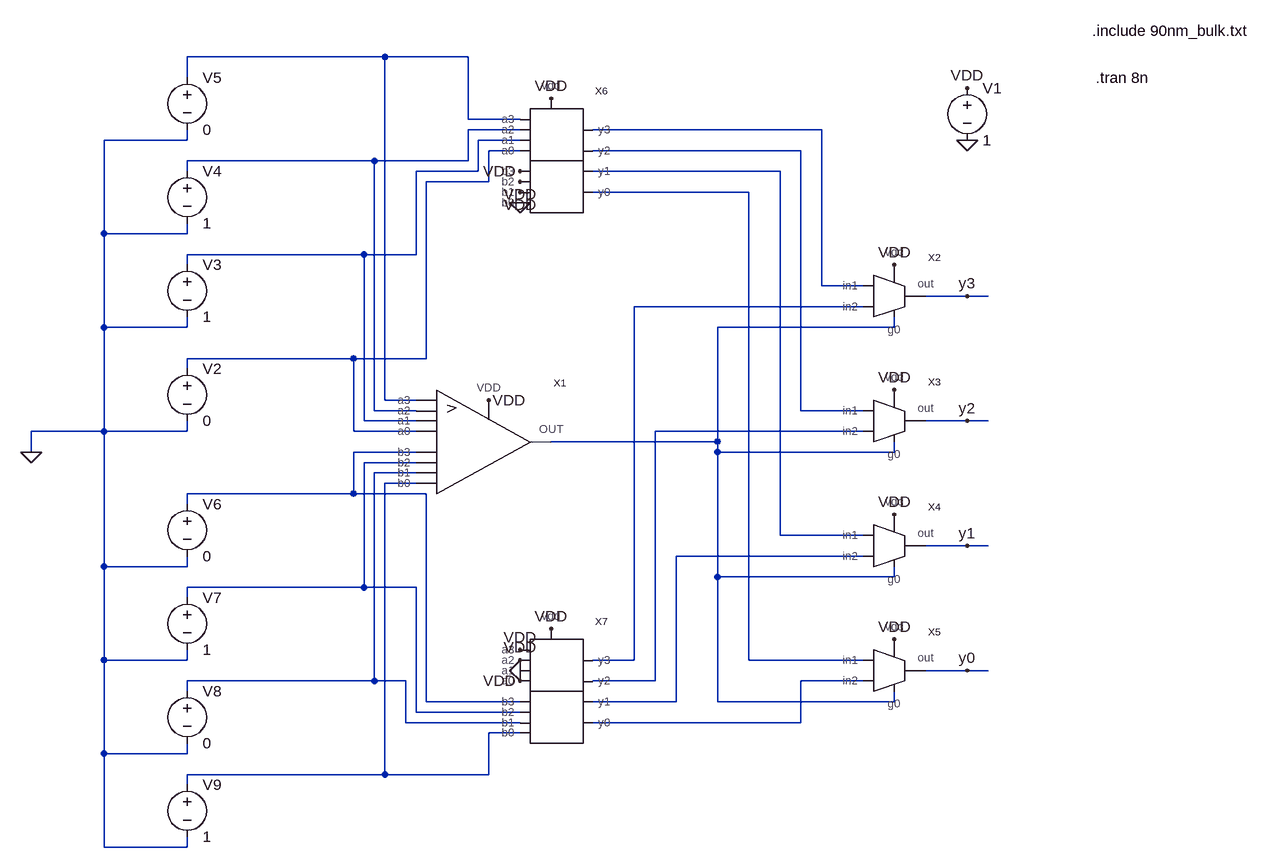
[diagram p0: schematic 2_exp2.asc]
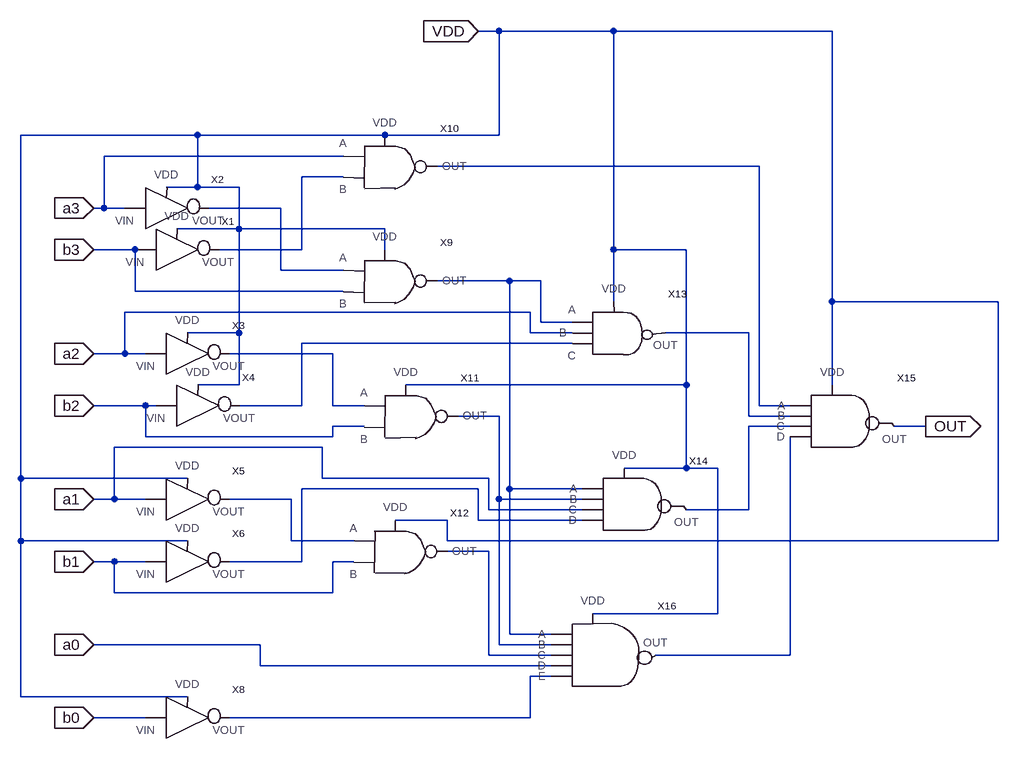
[diagram p1: sub-circuit comparator.asc]
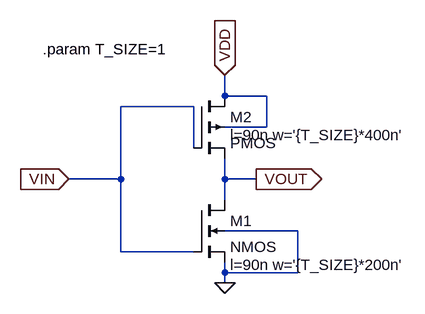
[diagram p2: sub-circuit inverter.asc]
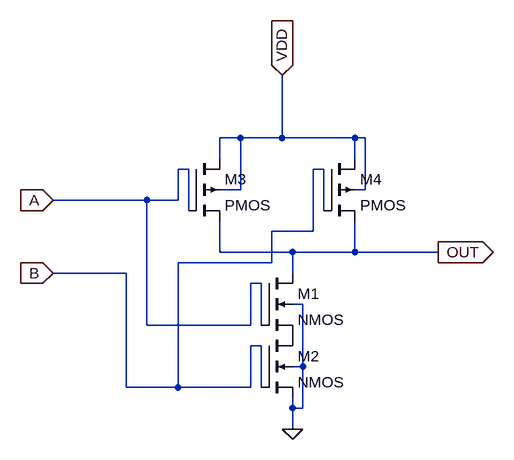
[diagram p3: sub-circuit nand.asc]
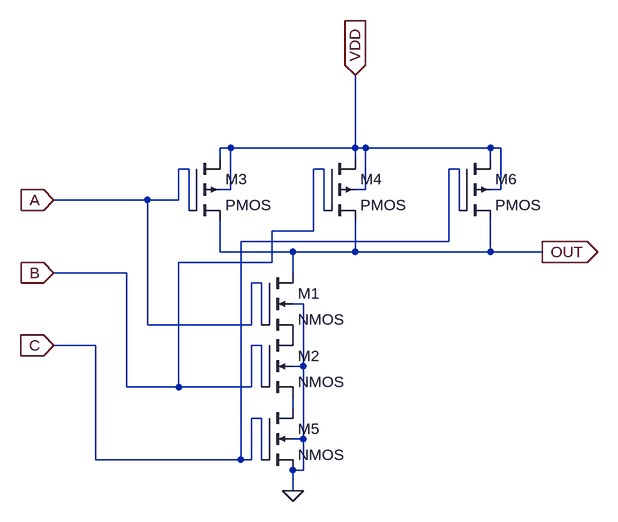
[diagram p4: sub-circuit nand3.asc]
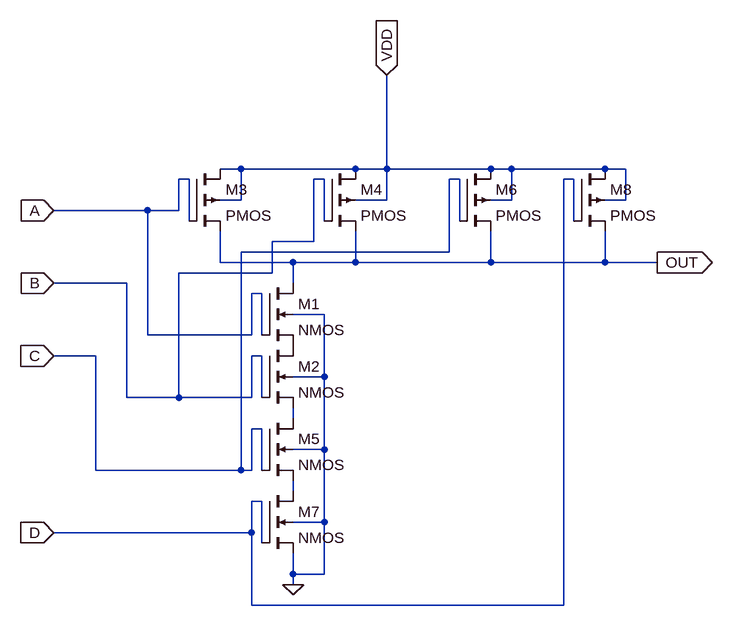
[diagram p5: sub-circuit nand4.asc]
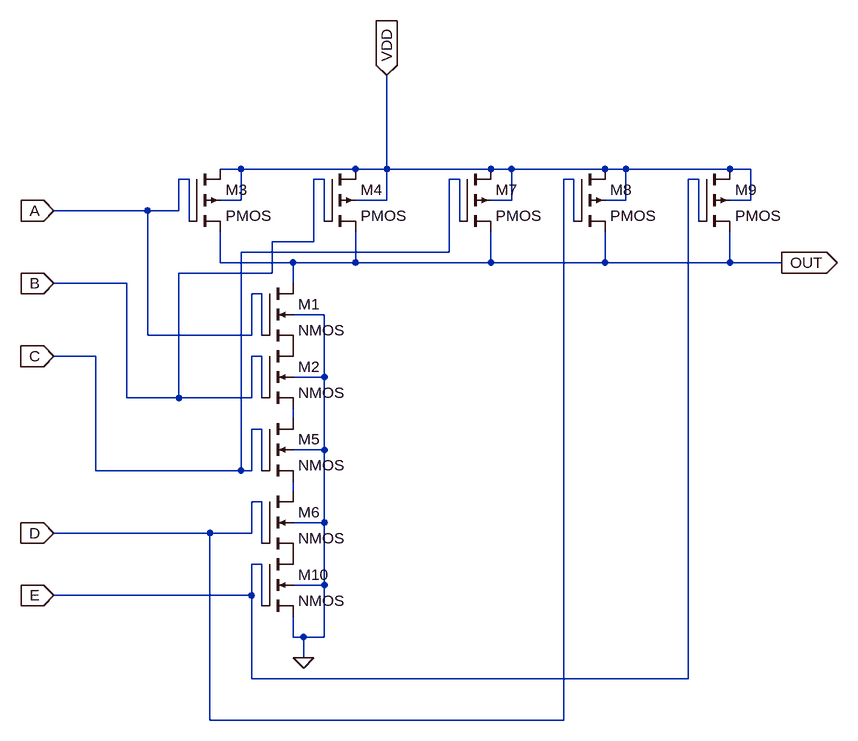
[diagram p6: sub-circuit nand5.asc]
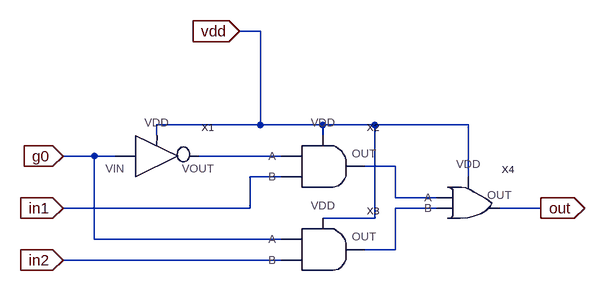
[diagram p7: sub-circuit mux.asc]
2_exp2.asc, the LTspice schematic file:
Version 4
SHEET 1 2052 804
WIRE 64 -416 -240 -416
WIRE 192 -416 64 -416
WIRE -240 -384 -240 -416
WIRE 192 -320 192 -416
WIRE 272 -320 192 -320
WIRE 272 -304 192 -304
WIRE 736 -304 384 -304
WIRE -240 -288 -240 -304
WIRE -240 -288 -368 -288
WIRE 272 -288 208 -288
WIRE 272 -272 224 -272
WIRE 704 -272 384 -272
WIRE 48 -256 -240 -256
WIRE 192 -256 192 -304
WIRE 192 -256 48 -256
WIRE -240 -240 -240 -256
WIRE 208 -240 208 -288
WIRE 208 -240 112 -240
WIRE 672 -240 384 -240
WIRE 224 -224 224 -272
WIRE 224 -224 128 -224
WIRE 624 -208 384 -208
WIRE -368 -144 -368 -288
WIRE -240 -144 -240 -160
WIRE -240 -144 -368 -144
WIRE 32 -112 -240 -112
WIRE 112 -112 112 -240
WIRE 112 -112 32 -112
WIRE -240 -96 -240 -112
WIRE 736 -64 736 -304
WIRE 800 -64 736 -64
WIRE 960 -48 896 -48
WIRE 992 -48 960 -48
WIRE 800 -32 448 -32
WIRE -368 0 -368 -144
WIRE -240 0 -240 -16
WIRE -240 0 -368 0
WIRE 848 0 848 -16
WIRE 848 0 576 0
WIRE 16 48 -240 48
WIRE 128 48 128 -224
WIRE 128 48 16 48
WIRE -240 64 -240 48
WIRE 64 112 64 -416
WIRE 112 112 64 112
WIRE 48 128 48 -256
WIRE 112 128 48 128
WIRE 704 128 704 -272
WIRE 800 128 704 128
WIRE 32 144 32 -112
WIRE 112 144 32 144
WIRE 960 144 896 144
WIRE 992 144 960 144
WIRE -368 160 -368 0
WIRE -368 160 -480 160
WIRE -240 160 -240 144
WIRE -240 160 -368 160
WIRE 16 160 16 48
WIRE 112 160 16 160
WIRE 800 160 480 160
WIRE 576 176 576 0
WIRE 576 176 320 176
WIRE -480 192 -480 160
WIRE 112 192 16 192
WIRE 576 192 576 176
WIRE 848 192 848 176
WIRE 848 192 576 192
WIRE 112 208 32 208
WIRE 112 224 48 224
WIRE 112 240 64 240
WIRE 16 256 16 192
WIRE 16 256 -240 256
WIRE 128 256 16 256
WIRE -240 272 -240 256
WIRE 672 320 672 -240
WIRE 800 320 672 320
WIRE 960 336 896 336
WIRE 992 336 960 336
WIRE 800 352 512 352
WIRE -368 368 -368 160
WIRE -240 368 -240 352
WIRE -240 368 -368 368
WIRE 576 384 576 192
WIRE 848 384 848 368
WIRE 848 384 576 384
WIRE 32 400 32 208
WIRE 32 400 -240 400
WIRE 112 400 32 400
WIRE -240 416 -240 400
WIRE -368 512 -368 368
WIRE -240 512 -240 496
WIRE -240 512 -368 512
WIRE 448 512 448 -32
WIRE 448 512 384 512
WIRE 624 512 624 -208
WIRE 800 512 624 512
WIRE 960 528 896 528
WIRE 992 528 960 528
WIRE 48 544 48 224
WIRE 48 544 -240 544
WIRE 96 544 48 544
WIRE 480 544 480 160
WIRE 480 544 384 544
WIRE 800 544 704 544
WIRE -240 560 -240 544
WIRE 128 576 128 256
WIRE 272 576 128 576
WIRE 512 576 512 352
WIRE 512 576 384 576
WIRE 576 576 576 384
WIRE 848 576 848 560
WIRE 848 576 576 576
WIRE 112 592 112 400
WIRE 272 592 112 592
WIRE 96 608 96 544
WIRE 272 608 96 608
WIRE 704 608 704 544
WIRE 704 608 384 608
WIRE 272 624 224 624
WIRE -368 656 -368 512
WIRE -240 656 -240 640
WIRE -240 656 -368 656
WIRE 64 688 64 240
WIRE 64 688 -240 688
WIRE 224 688 224 624
WIRE 224 688 64 688
WIRE -240 704 -240 688
WIRE -368 800 -368 656
WIRE -240 800 -240 784
WIRE -240 800 -368 800
FLAG 224 112 VDD
FLAG 848 -96 VDD
FLAG 848 96 VDD
FLAG 848 288 VDD
FLAG 848 480 VDD
FLAG -480 192 0
FLAG 272 -192 0
FLAG 320 -352 VDD
FLAG 272 -240 VDD
FLAG 272 -224 VDD
FLAG 272 -208 VDD
FLAG 272 528 0
FLAG 320 464 VDD
FLAG 272 496 VDD
FLAG 272 512 VDD
FLAG 272 544 VDD
FLAG 960 144 y2
FLAG 960 336 y1
FLAG 960 528 y0
FLAG 960 -48 y3
FLAG 960 -288 0
FLAG 960 -368 VDD
SYMBOL comparator 160 176 R0
SYMATTR InstName X1
SYMBOL mux 848 -48 R0
SYMATTR InstName X2
SYMBOL mux 848 144 R0
SYMATTR InstName X3
SYMBOL mux 848 336 R0
SYMATTR InstName X4
SYMBOL mux 848 528 R0
SYMATTR InstName X5
SYMBOL voltage -240 48 R0
WINDOW 123 0 0 Left 2
WINDOW 39 0 0 Left 2
SYMATTR InstName V2
SYMATTR Value 0
SYMBOL voltage -240 -112 R0
WINDOW 123 0 0 Left 2
WINDOW 39 0 0 Left 2
SYMATTR InstName V3
SYMATTR Value 1
SYMBOL voltage -240 -256 R0
WINDOW 123 0 0 Left 2
WINDOW 39 0 0 Left 2
SYMATTR InstName V4
SYMATTR Value 1
SYMBOL voltage -240 -400 R0
WINDOW 123 0 0 Left 2
WINDOW 39 0 0 Left 2
SYMATTR InstName V5
SYMATTR Value 0
SYMBOL voltage -240 256 R0
WINDOW 123 0 0 Left 2
WINDOW 39 0 0 Left 2
SYMATTR InstName V6
SYMATTR Value 0
SYMBOL voltage -240 400 R0
WINDOW 123 0 0 Left 2
WINDOW 39 0 0 Left 2
SYMATTR InstName V7
SYMATTR Value 1
SYMBOL voltage -240 544 R0
WINDOW 123 0 0 Left 2
WINDOW 39 0 0 Left 2
SYMATTR InstName V8
SYMATTR Value 0
SYMBOL voltage -240 688 R0
WINDOW 123 0 0 Left 2
WINDOW 39 0 0 Left 2
SYMATTR InstName V9
SYMATTR Value 1
SYMBOL summer 320 -272 R0
SYMATTR InstName X6
SYMBOL summer 320 544 R0
SYMATTR InstName X7
SYMBOL voltage 960 -384 R0
WINDOW 123 0 0 Left 2
WINDOW 39 0 0 Left 2
SYMATTR InstName V1
SYMATTR Value 1
TEXT 1152 -456 Left 2 !.include 90nm_bulk.txt
TEXT 1158 -384 Left 2 !.tran 8n

comparator.asc, the sub-circuit schematic file:
Version 4
SHEET 1 1444 904
WIRE 672 -224 640 -224
WIRE 848 -224 672 -224
WIRE 1184 -224 848 -224
WIRE 208 -64 -64 -64
WIRE 496 -64 208 -64
WIRE 672 -64 672 -224
WIRE 672 -64 496 -64
WIRE 432 -32 64 -32
WIRE 1072 -16 576 -16
WIRE 432 0 368 0
WIRE 208 16 208 -64
WIRE 208 16 160 16
WIRE 272 16 208 16
WIRE 64 48 64 -32
WIRE 64 48 48 48
WIRE 96 48 64 48
WIRE 336 48 224 48
WIRE 272 80 272 16
WIRE 272 80 176 80
WIRE 496 80 272 80
WIRE 112 112 48 112
WIRE 368 112 368 0
WIRE 368 112 240 112
WIRE 496 112 496 80
WIRE 848 112 848 -224
WIRE 960 112 848 112
WIRE 336 144 336 48
WIRE 432 144 336 144
WIRE 688 160 576 160
WIRE 736 160 688 160
WIRE 112 176 112 112
WIRE 432 176 112 176
WIRE 848 192 848 112
WIRE 1184 192 1184 -224
WIRE 1440 192 1184 192
WIRE 720 208 96 208
WIRE 736 224 736 160
WIRE 784 224 736 224
WIRE 272 240 272 80
WIRE 272 240 192 240
WIRE 720 240 720 208
WIRE 784 240 720 240
WIRE 1056 240 928 240
WIRE 784 256 368 256
WIRE 96 272 96 208
WIRE 96 272 48 272
WIRE 128 272 96 272
WIRE 416 272 256 272
WIRE 272 320 272 240
WIRE 272 320 208 320
WIRE 960 320 960 112
WIRE 960 320 528 320
WIRE 1184 320 1184 192
WIRE 128 352 48 352
WIRE 144 352 128 352
WIRE 368 352 368 256
WIRE 368 352 272 352
WIRE 416 352 416 272
WIRE 464 352 416 352
WIRE 1072 352 1072 -16
WIRE 1120 352 1072 352
WIRE 672 368 608 368
WIRE 1056 368 1056 240
WIRE 1120 368 1056 368
WIRE 464 384 416 384
WIRE 1120 384 1056 384
WIRE 1328 384 1280 384
WIRE 128 400 128 352
WIRE 416 400 416 384
WIRE 416 400 128 400
WIRE 400 416 80 416
WIRE 960 448 960 320
WIRE 960 448 864 448
WIRE 1008 448 960 448
WIRE -64 464 -64 -64
WIRE 192 464 -64 464
WIRE 400 464 400 416
WIRE 656 464 400 464
WIRE 640 480 368 480
WIRE 688 480 688 160
WIRE 800 480 688 480
WIRE 80 496 80 416
WIRE 80 496 48 496
WIRE 128 496 80 496
WIRE 352 496 256 496
WIRE 672 496 672 368
WIRE 800 496 672 496
WIRE 656 512 656 464
WIRE 800 512 656 512
WIRE 1056 512 1056 384
WIRE 1056 512 960 512
WIRE 592 528 512 528
WIRE 640 528 640 480
WIRE 800 528 640 528
WIRE -64 560 -64 464
WIRE 192 560 -64 560
WIRE 352 560 352 496
WIRE 448 560 352 560
WIRE 592 560 592 528
WIRE 1440 560 1440 192
WIRE 1440 560 592 560
WIRE 656 576 592 576
WIRE 80 592 48 592
WIRE 128 592 80 592
WIRE 368 592 368 480
WIRE 368 592 256 592
WIRE 448 592 416 592
WIRE 80 640 80 592
WIRE 416 640 416 592
WIRE 416 640 80 640
WIRE 1008 672 1008 448
WIRE 1008 672 816 672
WIRE 688 704 688 480
WIRE 752 704 688 704
WIRE 304 720 48 720
WIRE 672 720 672 496
WIRE 752 720 672 720
WIRE 656 736 656 576
WIRE 752 736 656 736
WIRE 1120 736 1120 400
WIRE 1120 736 912 736
WIRE 304 752 304 720
WIRE 752 752 304 752
WIRE 752 768 720 768
WIRE -64 800 -64 560
WIRE 192 800 -64 800
WIRE 128 832 48 832
WIRE 720 832 720 768
WIRE 720 832 256 832
FLAG 48 48 a3
IOPIN 48 48 In
FLAG 48 112 b3
IOPIN 48 112 In
FLAG 48 272 a2
IOPIN 48 272 In
FLAG 48 352 b2
IOPIN 48 352 In
FLAG 48 496 a1
IOPIN 48 496 In
FLAG 48 592 b1
IOPIN 48 592 In
FLAG 48 720 a0
IOPIN 48 720 In
FLAG 48 832 b0
IOPIN 48 832 In
FLAG 1328 384 OUT
IOPIN 1328 384 Out
FLAG 640 -224 VDD
IOPIN 640 -224 In
SYMBOL inverter 176 112 R0
SYMATTR InstName X1
SYMBOL inverter 160 48 R0
SYMATTR InstName X2
SYMBOL inverter 192 272 R0
SYMATTR InstName X3
SYMBOL inverter 208 352 R0
SYMATTR InstName X4
SYMBOL inverter 192 496 R0
SYMATTR InstName X5
SYMBOL inverter 192 592 R0
SYMATTR InstName X6
SYMBOL inverter 192 832 R0
SYMATTR InstName X8
SYMBOL nand 496 160 R0
SYMATTR InstName X9
SYMBOL nand 496 -16 R0
SYMATTR InstName X10
SYMBOL nand 528 368 R0
SYMATTR InstName X11
SYMBOL nand 512 576 R0
SYMATTR InstName X12
SYMBOL nand3 832 240 R0
SYMATTR InstName X13
SYMBOL nand4 864 512 R0
SYMATTR InstName X14
SYMBOL nand4 1184 384 R0
SYMATTR InstName X15
SYMBOL nand5 800 752 R0
SYMATTR InstName X16

inverter.asc, the sub-circuit schematic file:
Version 4
SHEET 1 880 680
WIRE 176 -128 176 -160
WIRE 240 -128 176 -128
WIRE 128 -112 16 -112
WIRE 240 -80 240 -128
WIRE 240 -80 176 -80
WIRE 128 -48 128 -112
WIRE 16 0 16 -112
WIRE 16 0 -64 0
WIRE 176 0 176 -32
WIRE 224 0 176 0
WIRE 176 32 176 0
WIRE 288 80 176 80
WIRE 16 112 16 0
WIRE 128 112 16 112
WIRE 176 144 176 128
WIRE 288 144 288 80
WIRE 288 144 176 144
WIRE 176 160 176 144
FLAG 176 160 0
FLAG -64 0 VIN
IOPIN -64 0 In
FLAG 224 0 VOUT
IOPIN 224 0 Out
FLAG 176 -160 VDD
IOPIN 176 -160 In
SYMBOL nmos4 128 32 R0
WINDOW 123 56 100 Left 2
SYMATTR InstName M1
SYMATTR Value2 l=90n w='{T_SIZE}*200n'
SYMBOL pmos4 128 -128 R0
WINDOW 123 56 60 Left 2
SYMATTR InstName M2
SYMATTR Value2 l=90n w='{T_SIZE}*400n'
TEXT -104 -200 Left 2 !.param T_SIZE=1

nand.asc, the sub-circuit schematic file:
Version 4
SHEET 1 880 680
WIRE 144 -80 112 -80
WIRE 208 -80 208 -176
WIRE 208 -80 144 -80
WIRE 320 -80 208 -80
WIRE 336 -80 320 -80
WIRE 112 -48 112 -80
WIRE 320 -48 320 -80
WIRE 64 -32 48 -32
WIRE 272 -32 256 -32
WIRE 144 0 144 -80
WIRE 144 0 112 0
WIRE 336 0 336 -80
WIRE 336 0 320 0
WIRE 0 16 -144 16
WIRE 48 16 48 -32
WIRE 48 16 0 16
WIRE 64 32 64 -32
WIRE 272 32 272 -32
WIRE 256 64 256 -32
WIRE 256 64 192 64
WIRE 112 96 112 48
WIRE 224 96 112 96
WIRE 320 96 320 48
WIRE 320 96 224 96
WIRE 448 96 320 96
WIRE 192 112 192 64
WIRE 192 112 48 112
WIRE -32 128 -144 128
WIRE 224 128 224 96
WIRE 176 144 160 144
WIRE 240 176 224 176
WIRE 0 208 0 16
WIRE 160 208 160 144
WIRE 160 208 0 208
WIRE 176 208 176 144
WIRE 176 240 160 240
WIRE 240 272 240 176
WIRE 240 272 224 272
WIRE -32 304 -32 128
WIRE 48 304 48 112
WIRE 48 304 -32 304
WIRE 160 304 160 240
WIRE 160 304 48 304
WIRE 176 304 176 240
WIRE 224 336 224 320
WIRE 240 336 240 272
WIRE 240 336 224 336
WIRE 224 368 224 336
FLAG 224 368 0
FLAG 448 96 OUT
IOPIN 448 96 Out
FLAG -144 16 A
IOPIN -144 16 In
FLAG -144 128 B
IOPIN -144 128 In
FLAG 208 -176 VDD
IOPIN 208 -176 In
SYMBOL nmos4 176 128 R0
SYMATTR InstName M1
SYMATTR Value2 l=90n w=200n
SYMBOL nmos4 176 224 R0
SYMATTR InstName M2
SYMATTR Value2 l=90n w=200n
SYMBOL pmos4 64 -48 R0
SYMATTR InstName M3
SYMATTR Value2 l=90n w=400n
SYMBOL pmos4 272 -48 R0
SYMATTR InstName M4
SYMATTR Value2 l=90n w=400n

nand3.asc, the sub-circuit schematic file:
Version 4
SHEET 1 880 680
WIRE 96 32 80 32
WIRE 288 32 288 -80
WIRE 288 32 96 32
WIRE 304 32 288 32
WIRE 496 32 304 32
WIRE 512 32 496 32
WIRE 80 48 80 32
WIRE 288 48 288 32
WIRE 496 48 496 32
WIRE 32 64 16 64
WIRE 240 64 224 64
WIRE 448 64 432 64
WIRE 96 96 96 32
WIRE 96 96 80 96
WIRE 304 96 304 32
WIRE 304 96 288 96
WIRE 512 96 512 32
WIRE 512 96 496 96
WIRE -32 112 -176 112
WIRE 16 112 16 64
WIRE 16 112 -32 112
WIRE 32 128 32 64
WIRE 240 128 240 64
WIRE 448 128 448 64
WIRE 224 160 224 64
WIRE 224 160 160 160
WIRE 432 176 432 64
WIRE 432 176 112 176
WIRE 80 192 80 144
WIRE 192 192 80 192
WIRE 288 192 288 144
WIRE 288 192 192 192
WIRE 496 192 496 144
WIRE 496 192 288 192
WIRE 576 192 496 192
WIRE 160 208 160 160
WIRE 160 208 16 208
WIRE -64 224 -176 224
WIRE 192 224 192 192
WIRE 144 240 128 240
WIRE 208 272 192 272
WIRE -32 304 -32 112
WIRE 128 304 128 240
WIRE 128 304 -32 304
WIRE 144 304 144 240
WIRE -112 336 -176 336
WIRE 144 336 128 336
WIRE 208 368 208 272
WIRE 208 368 192 368
WIRE -64 400 -64 224
WIRE 16 400 16 208
WIRE 16 400 -64 400
WIRE 128 400 128 336
WIRE 128 400 16 400
WIRE 144 400 144 336
WIRE 192 432 192 416
WIRE 144 448 128 448
WIRE 208 480 208 368
WIRE 208 480 192 480
WIRE -112 512 -112 336
WIRE 112 512 112 176
WIRE 112 512 -112 512
WIRE 128 512 128 448
WIRE 128 512 112 512
WIRE 144 512 144 448
WIRE 208 528 208 480
WIRE 208 528 192 528
WIRE 192 560 192 528
FLAG -176 112 A
IOPIN -176 112 In
FLAG -176 224 B
IOPIN -176 224 In
FLAG 192 560 0
FLAG 576 192 OUT
IOPIN 576 192 Out
FLAG -176 336 C
IOPIN -176 336 In
FLAG 288 -80 VDD
IOPIN 288 -80 In
SYMBOL nmos4 144 224 R0
SYMATTR InstName M1
SYMATTR Value2 l=90n w=200n
SYMBOL nmos4 144 320 R0
SYMATTR InstName M2
SYMATTR Value2 l=90n w=200n
SYMBOL pmos4 32 48 R0
SYMATTR InstName M3
SYMATTR Value2 l=90n w=400n
SYMBOL pmos4 240 48 R0
SYMATTR InstName M4
SYMATTR Value2 l=90n w=400n
SYMBOL nmos4 144 432 R0
SYMATTR InstName M5
SYMATTR Value2 l=90n w=200n
SYMBOL pmos4 448 48 R0
SYMATTR InstName M6
SYMATTR Value2 l=90n w=400n

nand4.asc, the sub-circuit schematic file:
Version 4
SHEET 1 880 680
WIRE -48 -16 -80 -16
WIRE 128 -16 -48 -16
WIRE 176 -16 176 -160
WIRE 176 -16 128 -16
WIRE 336 -16 176 -16
WIRE 368 -16 336 -16
WIRE 512 -16 368 -16
WIRE 544 -16 512 -16
WIRE -128 0 -144 0
WIRE 80 0 64 0
WIRE 288 0 272 0
WIRE 464 0 448 0
WIRE -48 32 -48 -16
WIRE -48 32 -80 32
WIRE 176 32 176 -16
WIRE 176 32 128 32
WIRE 368 32 368 -16
WIRE 368 32 336 32
WIRE 544 32 544 -16
WIRE 544 32 512 32
WIRE -192 48 -336 48
WIRE -144 48 -144 0
WIRE -144 48 -192 48
WIRE -128 64 -128 0
WIRE 80 64 80 0
WIRE 288 64 288 0
WIRE 464 64 464 0
WIRE 64 96 64 0
WIRE 64 96 0 96
WIRE 272 112 272 0
WIRE 272 112 -48 112
WIRE -80 128 -80 80
WIRE 32 128 -80 128
WIRE 128 128 128 80
WIRE 128 128 32 128
WIRE 336 128 336 80
WIRE 336 128 128 128
WIRE 512 128 512 80
WIRE 512 128 336 128
WIRE 592 128 512 128
WIRE 0 144 0 96
WIRE 0 144 -144 144
WIRE -224 160 -336 160
WIRE 32 160 32 128
WIRE -16 176 -32 176
WIRE 80 208 32 208
WIRE -192 240 -192 48
WIRE -32 240 -32 176
WIRE -32 240 -192 240
WIRE -16 240 -16 176
WIRE -272 272 -336 272
WIRE -16 272 -32 272
WIRE 80 304 80 208
WIRE 80 304 32 304
WIRE -224 336 -224 160
WIRE -144 336 -144 144
WIRE -144 336 -224 336
WIRE -32 336 -32 272
WIRE -32 336 -144 336
WIRE -16 336 -16 272
WIRE 32 368 32 352
WIRE -16 384 -32 384
WIRE 80 416 80 304
WIRE 80 416 32 416
WIRE -272 448 -272 272
WIRE -48 448 -48 112
WIRE -48 448 -272 448
WIRE -32 448 -32 384
WIRE -32 448 -48 448
WIRE -16 448 -16 384
WIRE 32 480 32 464
WIRE -16 496 -32 496
WIRE 80 528 80 416
WIRE 80 528 32 528
WIRE -32 544 -32 496
WIRE -32 544 -336 544
WIRE -16 560 -16 496
WIRE 32 608 32 576
WIRE 80 608 80 528
WIRE 80 608 32 608
WIRE 32 624 32 608
WIRE -32 656 -32 544
WIRE 448 656 448 0
WIRE 448 656 -32 656
FLAG -336 48 A
IOPIN -336 48 In
FLAG -336 160 B
IOPIN -336 160 In
FLAG -336 272 C
IOPIN -336 272 In
FLAG 32 624 0
FLAG 592 128 OUT
IOPIN 592 128 Out
FLAG -336 544 D
IOPIN -336 544 In
FLAG 176 -160 VDD
IOPIN 176 -160 In
SYMBOL nmos4 -16 160 R0
SYMATTR InstName M1
SYMATTR Value2 l=90n w=200n
SYMBOL nmos4 -16 256 R0
SYMATTR InstName M2
SYMATTR Value2 l=90n w=200n
SYMBOL pmos4 -128 -16 R0
SYMATTR InstName M3
SYMATTR Value2 l=90n w=400n
SYMBOL pmos4 80 -16 R0
SYMATTR InstName M4
SYMATTR Value2 l=90n w=400n
SYMBOL nmos4 -16 368 R0
SYMATTR InstName M5
SYMATTR Value2 l=90n w=200n
SYMBOL nmos4 -16 480 R0
SYMATTR InstName M7
SYMATTR Value2 l=90n w=200n
SYMBOL pmos4 288 -16 R0
SYMATTR InstName M6
SYMATTR Value2 l=90n w=400n
SYMBOL pmos4 464 -16 R0
SYMATTR InstName M8
SYMATTR Value2 l=90n w=400n

nand5.asc, the sub-circuit schematic file:
Version 4
SHEET 1 880 788
WIRE -80 -64 -112 -64
WIRE 96 -64 -80 -64
WIRE 144 -64 144 -208
WIRE 144 -64 96 -64
WIRE 304 -64 144 -64
WIRE 336 -64 304 -64
WIRE 480 -64 336 -64
WIRE 512 -64 480 -64
WIRE 672 -64 512 -64
WIRE 704 -64 672 -64
WIRE -160 -48 -176 -48
WIRE 48 -48 32 -48
WIRE 256 -48 240 -48
WIRE 432 -48 416 -48
WIRE 624 -48 608 -48
WIRE -80 -16 -80 -64
WIRE -80 -16 -112 -16
WIRE 144 -16 144 -64
WIRE 144 -16 96 -16
WIRE 336 -16 336 -64
WIRE 336 -16 304 -16
WIRE 512 -16 512 -64
WIRE 512 -16 480 -16
WIRE 704 -16 704 -64
WIRE 704 -16 672 -16
WIRE -224 0 -368 0
WIRE -176 0 -176 -48
WIRE -176 0 -224 0
WIRE -160 16 -160 -48
WIRE 48 16 48 -48
WIRE 256 16 256 -48
WIRE 432 16 432 -48
WIRE 624 16 624 -48
WIRE 32 48 32 -48
WIRE 32 48 -32 48
WIRE 240 64 240 -48
WIRE 240 64 -80 64
WIRE -112 80 -112 32
WIRE 0 80 -112 80
WIRE 96 80 96 32
WIRE 96 80 0 80
WIRE 304 80 304 32
WIRE 304 80 96 80
WIRE 480 80 480 32
WIRE 480 80 304 80
WIRE 672 80 672 32
WIRE 672 80 480 80
WIRE 752 80 672 80
WIRE -32 96 -32 48
WIRE -32 96 -176 96
WIRE -256 112 -368 112
WIRE 0 112 0 80
WIRE -48 128 -64 128
WIRE 48 160 0 160
WIRE -224 192 -224 0
WIRE -64 192 -64 128
WIRE -64 192 -224 192
WIRE -48 192 -48 128
WIRE -304 224 -368 224
WIRE -48 224 -64 224
WIRE 48 256 48 160
WIRE 48 256 0 256
WIRE -256 288 -256 112
WIRE -176 288 -176 96
WIRE -176 288 -256 288
WIRE -64 288 -64 224
WIRE -64 288 -176 288
WIRE -48 288 -48 224
WIRE 0 320 0 304
WIRE -48 336 -64 336
WIRE 48 368 48 256
WIRE 48 368 0 368
WIRE -304 400 -304 224
WIRE -80 400 -80 64
WIRE -80 400 -304 400
WIRE -64 400 -64 336
WIRE -64 400 -80 400
WIRE -48 400 -48 336
WIRE 0 432 0 416
WIRE -48 448 -64 448
WIRE 48 480 48 368
WIRE 48 480 0 480
WIRE -128 496 -368 496
WIRE -64 496 -64 448
WIRE -64 496 -128 496
WIRE -48 512 -48 448
WIRE -48 544 -64 544
WIRE 48 576 48 480
WIRE 48 576 0 576
WIRE -64 592 -64 544
WIRE -64 592 -368 592
WIRE -48 608 -48 544
WIRE 0 656 0 624
WIRE 16 656 0 656
WIRE 48 656 48 576
WIRE 48 656 16 656
WIRE 16 688 16 656
WIRE -64 720 -64 592
WIRE 608 720 608 -48
WIRE 608 720 -64 720
WIRE -128 784 -128 496
WIRE 416 784 416 -48
WIRE 416 784 -128 784
FLAG -368 0 A
IOPIN -368 0 In
FLAG -368 112 B
IOPIN -368 112 In
FLAG -368 224 C
IOPIN -368 224 In
FLAG -368 496 D
IOPIN -368 496 In
FLAG 144 -208 VDD
IOPIN 144 -208 In
FLAG 752 80 OUT
IOPIN 752 80 Out
FLAG 16 688 0
FLAG -368 592 E
IOPIN -368 592 In
SYMBOL nmos4 -48 112 R0
SYMATTR InstName M1
SYMATTR Value2 l=90n w=200n
SYMBOL nmos4 -48 208 R0
SYMATTR InstName M2
SYMATTR Value2 l=90n w=200n
SYMBOL pmos4 -160 -64 R0
SYMATTR InstName M3
SYMATTR Value2 l=90n w=400n
SYMBOL pmos4 48 -64 R0
SYMATTR InstName M4
SYMATTR Value2 l=90n w=400n
SYMBOL nmos4 -48 320 R0
SYMATTR InstName M5
SYMATTR Value2 l=90n w=200n
SYMBOL nmos4 -48 432 R0
SYMATTR InstName M6
SYMATTR Value2 l=90n w=200n
SYMBOL pmos4 256 -64 R0
SYMATTR InstName M7
SYMATTR Value2 l=90n w=400n
SYMBOL pmos4 432 -64 R0
SYMATTR InstName M8
SYMATTR Value2 l=90n w=400n
SYMBOL pmos4 624 -64 R0
SYMATTR InstName M9
SYMATTR Value2 l=90n w=400n
SYMBOL nmos4 -48 528 R0
SYMATTR InstName M10
SYMATTR Value2 l=90n w=200n

mux.asc, the sub-circuit schematic file:
Version 4
SHEET 1 944 680
WIRE 416 -112 384 -112
WIRE 416 32 416 -112
WIRE 416 32 256 32
WIRE 512 32 416 32
WIRE 592 32 512 32
WIRE 736 32 592 32
WIRE 256 48 256 32
WIRE 512 48 512 32
WIRE 160 80 112 80
WIRE 192 80 160 80
WIRE 448 80 320 80
WIRE 624 96 576 96
WIRE 448 112 400 112
WIRE 736 112 736 32
WIRE 624 144 624 96
WIRE 688 144 624 144
WIRE 400 160 400 112
WIRE 400 160 112 160
WIRE 688 160 624 160
WIRE 848 160 784 160
WIRE 592 176 592 32
WIRE 592 176 512 176
WIRE 160 208 160 80
WIRE 448 208 160 208
WIRE 624 224 624 160
WIRE 624 224 576 224
WIRE 448 240 112 240
FLAG 112 80 g0
IOPIN 112 80 In
FLAG 112 160 in1
IOPIN 112 160 In
FLAG 112 240 in2
IOPIN 112 240 In
FLAG 848 160 out
IOPIN 848 160 Out
FLAG 384 -112 vdd
IOPIN 384 -112 In
SYMBOL inverter 256 80 R0
SYMATTR InstName X1
SYMBOL and 496 96 R0
SYMATTR InstName X2
SYMBOL and 496 224 R0
SYMATTR InstName X3
SYMBOL or 752 160 R0
SYMATTR InstName X4

and.asc, the sub-circuit schematic file:
Version 4
SHEET 1 1116 788
WIRE 112 -32 80 -32
WIRE 176 -32 176 -128
WIRE 176 -32 112 -32
WIRE 288 -32 176 -32
WIRE 304 -32 288 -32
WIRE 592 -32 304 -32
WIRE 608 -32 592 -32
WIRE 80 0 80 -32
WIRE 288 0 288 -32
WIRE 32 16 16 16
WIRE 240 16 224 16
WIRE 592 16 592 -32
WIRE 544 32 432 32
WIRE 112 48 112 -32
WIRE 112 48 80 48
WIRE 304 48 304 -32
WIRE 304 48 288 48
WIRE -32 64 -176 64
WIRE 16 64 16 16
WIRE 16 64 -32 64
WIRE 608 64 608 -32
WIRE 608 64 592 64
WIRE 32 80 32 16
WIRE 240 80 240 16
WIRE 544 96 544 32
WIRE 224 112 224 16
WIRE 224 112 160 112
WIRE 80 144 80 96
WIRE 192 144 80 144
WIRE 288 144 288 96
WIRE 288 144 192 144
WIRE 432 144 432 32
WIRE 432 144 288 144
WIRE 592 144 592 112
WIRE 640 144 592 144
WIRE 160 160 160 112
WIRE 160 160 16 160
WIRE -64 176 -176 176
WIRE 192 176 192 144
WIRE 592 176 592 144
WIRE 144 192 128 192
WIRE 208 224 192 224
WIRE 704 224 592 224
WIRE -32 256 -32 64
WIRE 128 256 128 192
WIRE 128 256 -32 256
WIRE 144 256 144 192
WIRE 432 256 432 144
WIRE 544 256 432 256
WIRE 144 288 128 288
WIRE 592 288 592 272
WIRE 704 288 704 224
WIRE 704 288 592 288
WIRE 592 304 592 288
WIRE 208 320 208 224
WIRE 208 320 192 320
WIRE -64 352 -64 176
WIRE 16 352 16 160
WIRE 16 352 -64 352
WIRE 128 352 128 288
WIRE 128 352 16 352
WIRE 144 352 144 288
WIRE 192 384 192 368
WIRE 208 384 208 320
WIRE 208 384 192 384
WIRE 192 416 192 384
FLAG 192 416 0
FLAG -176 64 A
IOPIN -176 64 In
FLAG -176 176 B
IOPIN -176 176 In
FLAG 176 -128 VDD
IOPIN 176 -128 In
FLAG 592 304 0
FLAG 640 144 OUT
IOPIN 640 144 Out
SYMBOL nmos4 144 176 R0
SYMATTR InstName M1
SYMATTR Value2 l=90n w=200n
SYMBOL nmos4 144 272 R0
SYMATTR InstName M2
SYMATTR Value2 l=90n w=200n
SYMBOL pmos4 32 0 R0
SYMATTR InstName M3
SYMATTR Value2 l=90n w=400n
SYMBOL pmos4 240 0 R0
SYMATTR InstName M4
SYMATTR Value2 l=90n w=400n
SYMBOL nmos4 544 176 R0
SYMATTR Value2 l=90n w=200n
SYMATTR InstName M5
SYMBOL pmos4 544 16 R0
SYMATTR Value2 l=90n w=400n
SYMATTR InstName M6

or.asc, the sub-circuit schematic file:
Version 4
SHEET 1 1084 680
WIRE 32 -32 32 -64
WIRE 64 -32 32 -32
WIRE 464 -32 64 -32
WIRE 32 -16 32 -32
WIRE -16 0 -32 0
WIRE 64 32 64 -32
WIRE 64 32 32 32
WIRE 464 48 464 -32
WIRE 480 48 464 48
WIRE -64 64 -208 64
WIRE -32 64 -32 0
WIRE -32 64 -64 64
WIRE -16 64 -16 0
WIRE -16 96 -32 96
WIRE 464 96 464 48
WIRE 416 112 304 112
WIRE 64 128 64 32
WIRE 64 128 32 128
WIRE 480 144 480 48
WIRE 480 144 464 144
WIRE -16 160 -16 96
WIRE 416 176 416 112
WIRE -112 192 -208 192
WIRE -32 192 -32 96
WIRE -32 192 -112 192
WIRE 32 224 32 176
WIRE 80 224 32 224
WIRE 224 224 80 224
WIRE 304 224 304 112
WIRE 304 224 224 224
WIRE 464 224 464 192
WIRE 512 224 464 224
WIRE 32 240 16 240
WIRE 176 240 160 240
WIRE 464 256 464 224
WIRE 112 272 80 272
WIRE 256 272 224 272
WIRE 32 304 32 240
WIRE 176 304 176 240
WIRE 576 304 464 304
WIRE -64 320 -64 64
WIRE 16 320 16 240
WIRE 16 320 -64 320
WIRE 80 336 80 320
WIRE 112 336 112 272
WIRE 112 336 80 336
WIRE 224 336 224 320
WIRE 256 336 256 272
WIRE 256 336 224 336
WIRE 304 336 304 224
WIRE 416 336 304 336
WIRE 80 352 80 336
WIRE 224 352 224 336
WIRE 464 368 464 352
WIRE 576 368 576 304
WIRE 576 368 464 368
WIRE 464 384 464 368
WIRE -112 400 -112 192
WIRE 160 400 160 240
WIRE 160 400 -112 400
FLAG 32 -64 VDD
IOPIN 32 -64 In
FLAG 80 352 0
FLAG 224 352 0
FLAG -208 64 A
IOPIN -208 64 In
FLAG -208 192 B
IOPIN -208 192 In
FLAG 464 384 0
FLAG 512 224 OUT
IOPIN 512 224 Out
SYMBOL pmos4 -16 -16 R0
SYMATTR InstName M1
SYMATTR Value2 l=90n w=400n
SYMBOL pmos4 -16 80 R0
SYMATTR InstName M2
SYMATTR Value2 l=90n w=400n
SYMBOL nmos4 32 224 R0
SYMATTR InstName M3
SYMATTR Value2 l=90n w=200n
SYMBOL nmos4 176 224 R0
SYMATTR InstName M4
SYMATTR Value2 l=90n w=200n
SYMBOL nmos4 416 256 R0
SYMATTR Value2 l=90n w=200n
SYMATTR InstName M5
SYMBOL pmos4 416 96 R0
SYMATTR Value2 l=90n w=400n
SYMATTR InstName M6

summer.asc, the sub-circuit schematic file:
Version 4
SHEET 1 1508 680
WIRE 272 -1072 -256 -1072
WIRE 1040 -1072 272 -1072
WIRE 1312 -1072 1040 -1072
WIRE 1312 -1056 1312 -1072
WIRE 272 -1040 272 -1072
WIRE 128 -1024 32 -1024
WIRE 1264 -1024 832 -1024
WIRE 128 -1008 128 -1024
WIRE 224 -1008 128 -1008
WIRE 1264 -1008 1216 -1008
WIRE 1424 -1008 1360 -1008
WIRE 224 -992 128 -992
WIRE 832 -992 832 -1024
WIRE 832 -992 320 -992
WIRE 128 -944 128 -992
WIRE 128 -944 32 -944
WIRE 1040 -912 1040 -1072
WIRE 1120 -912 1040 -912
WIRE 1120 -896 1120 -912
WIRE 1072 -864 480 -864
WIRE 1072 -848 1008 -848
WIRE 1216 -848 1216 -1008
WIRE 1216 -848 1168 -848
WIRE -256 -800 -256 -1072
WIRE 256 -800 -256 -800
WIRE 880 -800 256 -800
WIRE 880 -768 880 -800
WIRE 256 -752 256 -800
WIRE 816 -736 704 -736
WIRE 192 -720 64 -720
WIRE 1008 -720 1008 -848
WIRE 1008 -720 944 -720
WIRE 480 -704 480 -864
WIRE 480 -704 320 -704
WIRE 192 -688 96 -688
WIRE -256 -640 -256 -800
WIRE 256 -640 -256 -640
WIRE 912 -640 256 -640
WIRE -256 -608 -256 -640
WIRE -256 -608 -400 -608
WIRE 64 -592 64 -720
WIRE 64 -592 32 -592
WIRE 160 -592 64 -592
WIRE 256 -592 256 -640
WIRE 912 -592 912 -640
WIRE 160 -560 160 -592
WIRE 208 -560 160 -560
WIRE 704 -560 704 -736
WIRE 864 -560 704 -560
WIRE 208 -544 160 -544
WIRE 704 -544 704 -560
WIRE 704 -544 304 -544
WIRE 816 -544 816 -704
WIRE 864 -544 816 -544
WIRE 1040 -544 960 -544
WIRE 96 -512 96 -688
WIRE 96 -512 32 -512
WIRE 160 -512 160 -544
WIRE 160 -512 96 -512
WIRE -256 -464 -256 -608
WIRE 704 -464 -256 -464
WIRE 704 -448 704 -464
WIRE 656 -416 352 -416
WIRE 656 -400 608 -400
WIRE 816 -400 816 -544
WIRE 816 -400 752 -400
WIRE -256 -368 -256 -464
WIRE 496 -368 -256 -368
WIRE 496 -336 496 -368
WIRE 432 -304 368 -304
WIRE -256 -288 -256 -368
WIRE 256 -288 -256 -288
WIRE 608 -288 608 -400
WIRE 608 -288 560 -288
WIRE 432 -272 384 -272
WIRE 256 -256 256 -288
WIRE 192 -224 64 -224
WIRE 352 -208 352 -416
WIRE 352 -208 320 -208
WIRE 192 -192 96 -192
WIRE -256 -144 -256 -288
WIRE 256 -144 -256 -144
WIRE 560 -144 256 -144
WIRE 256 -112 256 -144
WIRE 560 -112 560 -144
WIRE 64 -96 64 -224
WIRE 64 -96 32 -96
WIRE 160 -96 64 -96
WIRE 160 -80 160 -96
WIRE 208 -80 160 -80
WIRE 512 -80 400 -80
WIRE 208 -64 160 -64
WIRE 368 -64 368 -304
WIRE 368 -64 304 -64
WIRE 400 -64 400 -80
WIRE 400 -64 368 -64
WIRE 512 -64 448 -64
WIRE 688 -64 608 -64
WIRE 96 -16 96 -192
WIRE 96 -16 32 -16
WIRE 160 -16 160 -64
WIRE 160 -16 96 -16
WIRE -256 64 -256 -144
WIRE 272 64 -256 64
WIRE 272 80 272 64
WIRE 208 112 64 112
WIRE 384 128 384 -272
WIRE 384 128 336 128
WIRE 448 128 448 -64
WIRE 448 128 384 128
WIRE 208 144 96 144
WIRE -256 192 -256 64
WIRE 272 192 -256 192
WIRE 64 240 64 112
WIRE 64 240 32 240
WIRE 144 240 64 240
WIRE 272 240 272 192
WIRE 144 272 144 240
WIRE 224 272 144 272
WIRE 224 288 144 288
WIRE 400 288 320 288
WIRE 96 320 96 144
WIRE 96 320 32 320
WIRE 144 320 144 288
WIRE 144 320 96 320
FLAG 32 240 a0
IOPIN 32 240 In
FLAG 32 320 b0
IOPIN 32 320 In
FLAG 32 -16 b1
IOPIN 32 -16 In
FLAG 32 -96 a1
IOPIN 32 -96 In
FLAG 32 -512 b2
IOPIN 32 -512 In
FLAG 32 -592 a2
IOPIN 32 -592 In
FLAG 32 -944 b3
IOPIN 32 -944 In
FLAG 32 -1024 a3
IOPIN 32 -1024 In
FLAG 1424 -1008 y3
IOPIN 1424 -1008 Out
FLAG 1040 -544 y2
IOPIN 1040 -544 Out
FLAG 688 -64 y1
IOPIN 688 -64 Out
FLAG 400 288 y0
IOPIN 400 288 Out
FLAG -400 -608 vdd
IOPIN -400 -608 In
SYMBOL xor 272 288 R0
SYMATTR InstName X1
SYMBOL and 256 128 R0
SYMATTR InstName X2
SYMBOL xor 256 -64 R0
SYMATTR InstName X3
SYMBOL xor 560 -64 R0
SYMATTR InstName X4
SYMBOL and 240 -208 R0
SYMATTR InstName X5
SYMBOL and 480 -288 R0
SYMATTR InstName X6
SYMBOL or 720 -400 R0
SYMATTR InstName X7
SYMBOL xor 256 -544 R0
SYMATTR InstName X8
SYMBOL xor 912 -544 R0
SYMATTR InstName X9
SYMBOL and 240 -704 R0
SYMATTR InstName X10
SYMBOL and 864 -720 R0
SYMATTR InstName X11
SYMBOL or 1136 -848 R0
SYMATTR InstName X12
SYMBOL xor 272 -992 R0
SYMATTR InstName X13
SYMBOL xor 1312 -1008 R0
SYMATTR InstName X14

xor.asc, the sub-circuit schematic file:
Version 4
SHEET 1 1104 680
WIRE 416 -112 416 -208
WIRE 416 -112 240 -112
WIRE 448 -112 416 -112
WIRE 544 -112 448 -112
WIRE 832 -112 544 -112
WIRE 544 -32 544 -112
WIRE 480 0 112 0
WIRE 688 16 624 16
WIRE 480 32 416 32
WIRE 112 48 112 0
WIRE 112 48 80 48
WIRE 240 64 240 -112
WIRE 832 80 832 -112
WIRE 112 96 112 48
WIRE 176 96 112 96
WIRE 416 112 416 32
WIRE 416 112 320 112
WIRE 688 112 688 16
WIRE 768 112 688 112
WIRE 176 128 112 128
WIRE 1008 128 912 128
WIRE 768 144 688 144
WIRE 112 176 112 128
WIRE 112 176 80 176
WIRE 448 192 448 -112
WIRE 544 192 448 192
WIRE 416 224 416 112
WIRE 480 224 416 224
WIRE 688 240 688 144
WIRE 688 240 624 240
WIRE 112 256 112 176
WIRE 480 256 112 256
FLAG 80 48 a
IOPIN 80 48 In
FLAG 80 176 b
IOPIN 80 176 In
FLAG 1008 128 out
IOPIN 1008 128 Out
FLAG 416 -208 vdd
IOPIN 416 -208 In
SYMBOL nand 240 112 R0
SYMATTR InstName X1
SYMBOL nand 544 16 R0
SYMATTR InstName X2
SYMBOL nand 544 240 R0
SYMATTR InstName X3
SYMBOL nand 832 128 R0
SYMATTR InstName X4

The netlist it stands for:
* 2_exp2.asc
XX1 N001 N002 N004 N005 N012 N013 N014 N015 VDD N010 comparator
XX2 N010 N003 N009 VDD y3 mux
XX3 N010 N006 N011 VDD y2 mux
XX4 N010 N007 N016 VDD y1 mux
XX5 N010 N008 N017 VDD y0 mux
V2 N005 0 0
V3 N004 0 1
V4 N002 0 1
V5 N001 0 0
V6 N012 0 0
V7 N013 0 1
V8 N014 0 0
V9 N015 0 1
XX6 N001 N002 N004 N005 VDD VDD VDD 0 VDD N003 N006 N007 N008 summer
XX7 VDD VDD 0 VDD N012 N013 N014 N015 VDD N009 N011 N016 N017 summer
V1 VDD 0 1

* block symbol definitions
.subckt comparator a3 a2 a1 a0 b3 b2 b1 b0 VDD OUT
XX1 b3 VDD N002 inverter
XX2 a3 VDD N003 inverter
XX3 a2 VDD N007 inverter
XX4 b2 VDD N006 inverter
XX5 a1 VDD N011 inverter
XX6 b1 VDD N010 inverter
XX8 b0 VDD N014 inverter
XX9 N003 b3 N004 VDD nand
XX10 a3 N002 N001 VDD nand
XX11 N007 b2 N008 VDD nand
XX12 N011 b1 N012 VDD nand
XX13 N004 a2 N006 VDD N005 nand3
XX14 N009 VDD N004 N008 a1 N010 nand4
XX15 OUT VDD N001 N005 N009 N013 nand4
XX16 N004 N008 N012 a0 N014 VDD N013 nand5
.ends comparator

.subckt inverter VIN VDD VOUT
M1 VOUT VIN 0 0 NMOS l=90n w='{T_SIZE}*200n'
M2 VDD VIN VOUT VDD PMOS l=90n w='{T_SIZE}*400n'
.param T_SIZE=1
.ends inverter

.subckt nand A B OUT VDD
M1 OUT A P001 0 NMOS l=90n w=200n
M2 P001 B 0 0 NMOS l=90n w=200n
M3 VDD A OUT VDD PMOS l=90n w=400n
M4 VDD B OUT VDD PMOS l=90n w=400n
.ends nand

.subckt nand3 A B C VDD OUT
M1 OUT A P001 0 NMOS l=90n w=200n
M2 P001 B N001 0 NMOS l=90n w=200n
M3 VDD A OUT VDD PMOS l=90n w=400n
M4 VDD B OUT VDD PMOS l=90n w=400n
M5 N001 C 0 0 NMOS l=90n w=200n
M6 VDD C OUT VDD PMOS l=90n w=400n
.ends nand3

.subckt nand4 OUT VDD A B C D
M1 OUT A P001 0 NMOS l=90n w=200n
M2 P001 B N001 0 NMOS l=90n w=200n
M3 VDD A OUT VDD PMOS l=90n w=400n
M4 VDD B OUT VDD PMOS l=90n w=400n
M5 N001 C N002 0 NMOS l=90n w=200n
M7 N002 D 0 0 NMOS l=90n w=200n
M6 VDD C OUT VDD PMOS l=90n w=400n
M8 VDD D OUT VDD PMOS l=90n w=400n
.ends nand4

.subckt nand5 A B C D E VDD OUT
M1 OUT A P001 0 NMOS l=90n w=200n
M2 P001 B N001 0 NMOS l=90n w=200n
M3 VDD A OUT VDD PMOS l=90n w=400n
M4 VDD B OUT VDD PMOS l=90n w=400n
M5 N001 C N002 0 NMOS l=90n w=200n
M6 N002 D P002 0 NMOS l=90n w=200n
M7 VDD C OUT VDD PMOS l=90n w=400n
M8 VDD D OUT VDD PMOS l=90n w=400n
M9 VDD E OUT VDD PMOS l=90n w=400n
M10 P002 E 0 0 NMOS l=90n w=200n
.ends nand5

.subckt mux g0 in1 in2 vdd out
XX1 g0 vdd N001 inverter
XX2 vdd N001 in1 N002 and
XX3 vdd g0 in2 N003 and
XX4 N002 N003 vdd out or
.ends mux

.subckt and VDD A B OUT
M1 N001 A P001 0 NMOS l=90n w=200n
M2 P001 B 0 0 NMOS l=90n w=200n
M3 VDD A N001 VDD PMOS l=90n w=400n
M4 VDD B N001 VDD PMOS l=90n w=400n
M5 OUT N001 0 0 NMOS l=90n w=200n
M6 VDD N001 OUT VDD PMOS l=90n w=400n
.ends and

.subckt or A B VDD OUT
M1 VDD A P001 VDD PMOS l=90n w=400n
M2 P001 B N001 VDD PMOS l=90n w=400n
M3 N001 A 0 0 NMOS l=90n w=200n
M4 N001 B 0 0 NMOS l=90n w=200n
M5 OUT N001 0 0 NMOS l=90n w=200n
M6 VDD N001 OUT VDD PMOS l=90n w=400n
.ends or

.subckt summer a3 a2 a1 a0 b3 b2 b1 b0 vdd y3 y2 y1 y0
XX1 a0 b0 vdd y0 xor
XX2 vdd a0 b0 N010 and
XX3 a1 b1 vdd N009 xor
XX4 N009 N010 vdd y1 xor
XX5 vdd a1 b1 N007 and
XX6 vdd N009 N010 N008 and
XX7 N007 N008 vdd N006 or
XX8 a2 b2 vdd N005 xor
XX9 N005 N006 vdd y2 xor
XX10 vdd a2 b2 N003 and
XX11 vdd N005 N006 N004 and
XX12 N003 N004 vdd N002 or
XX13 a3 b3 vdd N001 xor
XX14 N001 N002 vdd y3 xor
.ends summer

.subckt xor a b vdd out
XX1 a b N002 vdd nand
XX2 a N002 N001 vdd nand
XX3 N002 b N003 vdd nand
XX4 N001 N003 out vdd nand
.ends xor

.model NMOS NMOS
.model PMOS PMOS
.lib standard.mos
.include 90nm_bulk.txt
.tran 8n
.backanno
.end